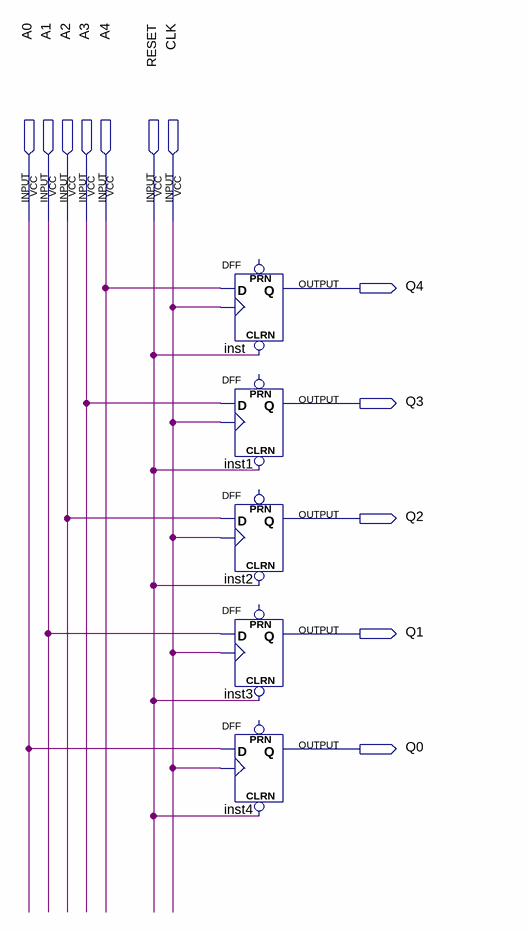
[diagram p0: schematic sheet]
// Quartus schematic reg5pipo1reset.bdf as structural Verilog: 5 symbols, 12 pins
module reg5pipo1reset (
  input  A0,
  input  A1,
  input  A2,
  input  A3,
  input  A4,
  input  RESET,
  input  CLK,
  output Q4,
  output Q3,
  output Q2,
  output Q1,
  output Q0
);

  DFF inst (.CLRN(RESET), .CLK(CLK), .D(A4), .Q(Q4));  // open: PRN
  DFF inst1 (.CLRN(RESET), .CLK(CLK), .D(A3), .Q(Q3));  // open: PRN
  DFF inst2 (.CLRN(RESET), .CLK(CLK), .D(A2), .Q(Q2));  // open: PRN
  DFF inst3 (.CLRN(RESET), .CLK(CLK), .D(A1), .Q(Q1));  // open: PRN
  DFF inst4 (.CLRN(RESET), .CLK(CLK), .D(A0), .Q(Q0));  // open: PRN
endmodule
